# Altium project CURRENT_MEASURE.PrjPCB
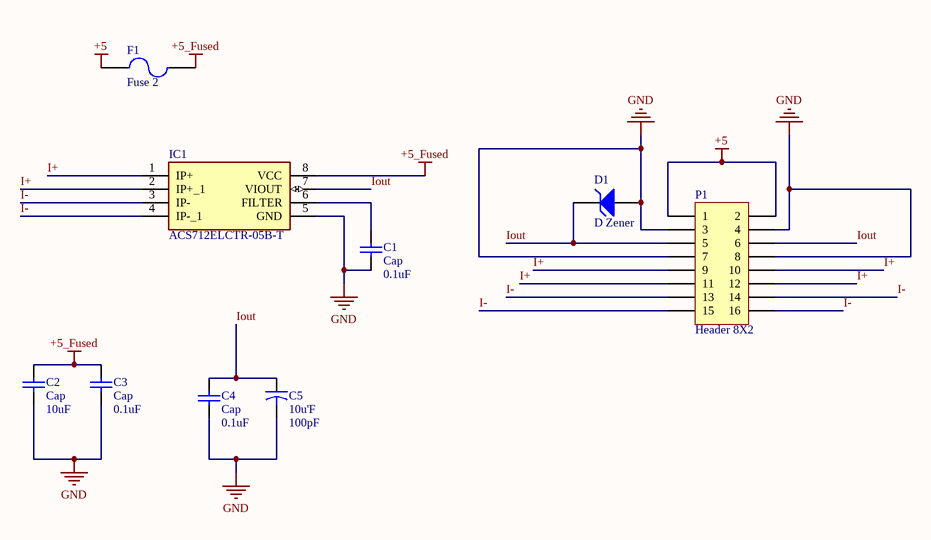
[diagram p0: CURRENT_MEASURE.SchDoc]
1 sheet, 9 parts. Net scope: global (net labels, ports and power ports of the same name join across sheets).
Board file: CURRENT_MEASURE.PcbDoc

## Sheet CURRENT_MEASURE.SchDoc
size A4

### Parts
C1  Cap  value 0.1uF  [1608[0603]]
C2  Cap  value 10uF  [C1210]
C3  Cap  value 0.1uF  [1608[0603]]
C4  Cap  value 0.1uF  [1608[0603]]
C5  10u'F  value 100pF  [CAP-6]
D1  D Zener  [C1206]
F1  Fuse 2  [C1206]
IC1  ACS712ELCTR-05B-T  [SOIC127P600X175-8N]
P1  Header 8X2  [HDR2X8]

### Nets
+5: F1.2 P1.1 P1.2
+5_Fused: C2.2 C3.1 F1.1 IC1.8(VCC)
GND: C1.2 C2.1 C3.2 C4.2 C5.2 D1.1(A) IC1.5(GND) P1.3 P1.4 P1.7 P1.8
I+: IC1.1(IP+) IC1.2(IP+_1) P1.9 P1.10 P1.11 P1.12
I-: IC1.3(IP-) IC1.4(IP-_1) P1.13 P1.14 P1.15 P1.16
Iout: C4.1 C5.1 D1.2(K) IC1.7(VIOUT) P1.5 P1.6
NetC1_1: C1.1 IC1.6(FILTER)

### Library data of the parts
C1-C4 = Cap: Capacitor; Published: 8-Jun-2000; LatestRevisionDate: 17-Jul-2002; LatestRevisionNote: Re-released for DXP Platform.; PackageReference: RAD-0.3; Publisher: Altium Limited; PackageDescription: Radial Cap, Thru-Hole; 2 Leads; 0.3 in Pin Spacing
C5 = Cap2: Capacitor; Published: 23-Sep-2002; PackageReference: CAPR5-4X5; Publisher: Altium Limited; PackageDescription: Capacitor; 2 Leads
D1 = D Zener: Zener Diode; Published: 8-Jun-2000; LatestRevisionDate: 17-Jul-2002; LatestRevisionNote: Re-released for DXP Platform.; PackageReference: DIODE-0.7; Publisher: Altium Limited; PackageDescription: Diode, Thru-Hole; 2 Leads; 0.7 in Pin Spacing
F1 = Fuse 2: Fuse; Published: 8-Jun-2000; LatestRevisionDate: 17-Jul-2002; LatestRevisionNote: Re-released for DXP Platform.; PackageReference: PIN-W2/E2.8; Publisher: Altium Limited; PackageDescription: Thru-Hole; 2 Leads
IC1 = ACS712ELCTR-05B-T: Integrated Circuit; Manufacturer_Name: Allegro Microsystems; Allied_Number: R1076681; Datasheet Link: http://docs-emea.rs-online.com/webdocs/0d88/0900766b80d885f5.pdf; Height: 1.75mm; Manufacturer_Part_Number: ACS712ELCTR-05B-T; RS Part Number: 1729270; RS Price/Stock: http://uk.rs-online.com/web/p/products/1729270; Allied Price/Stock: http://www.alliedelec.com/allegro-microsystems-acs712elctr-05b-t/R1076681/
P1 = Header 8X2: Header, 8-Pin, Dual row; LatestRevisionDate: 17-Jul-2002; LatestRevisionNote: Re-released for DXP Platform.; Publisher: Altium Limited